# EAGLE board RF08old (EAGLE 6.6.0), part 1 of 2
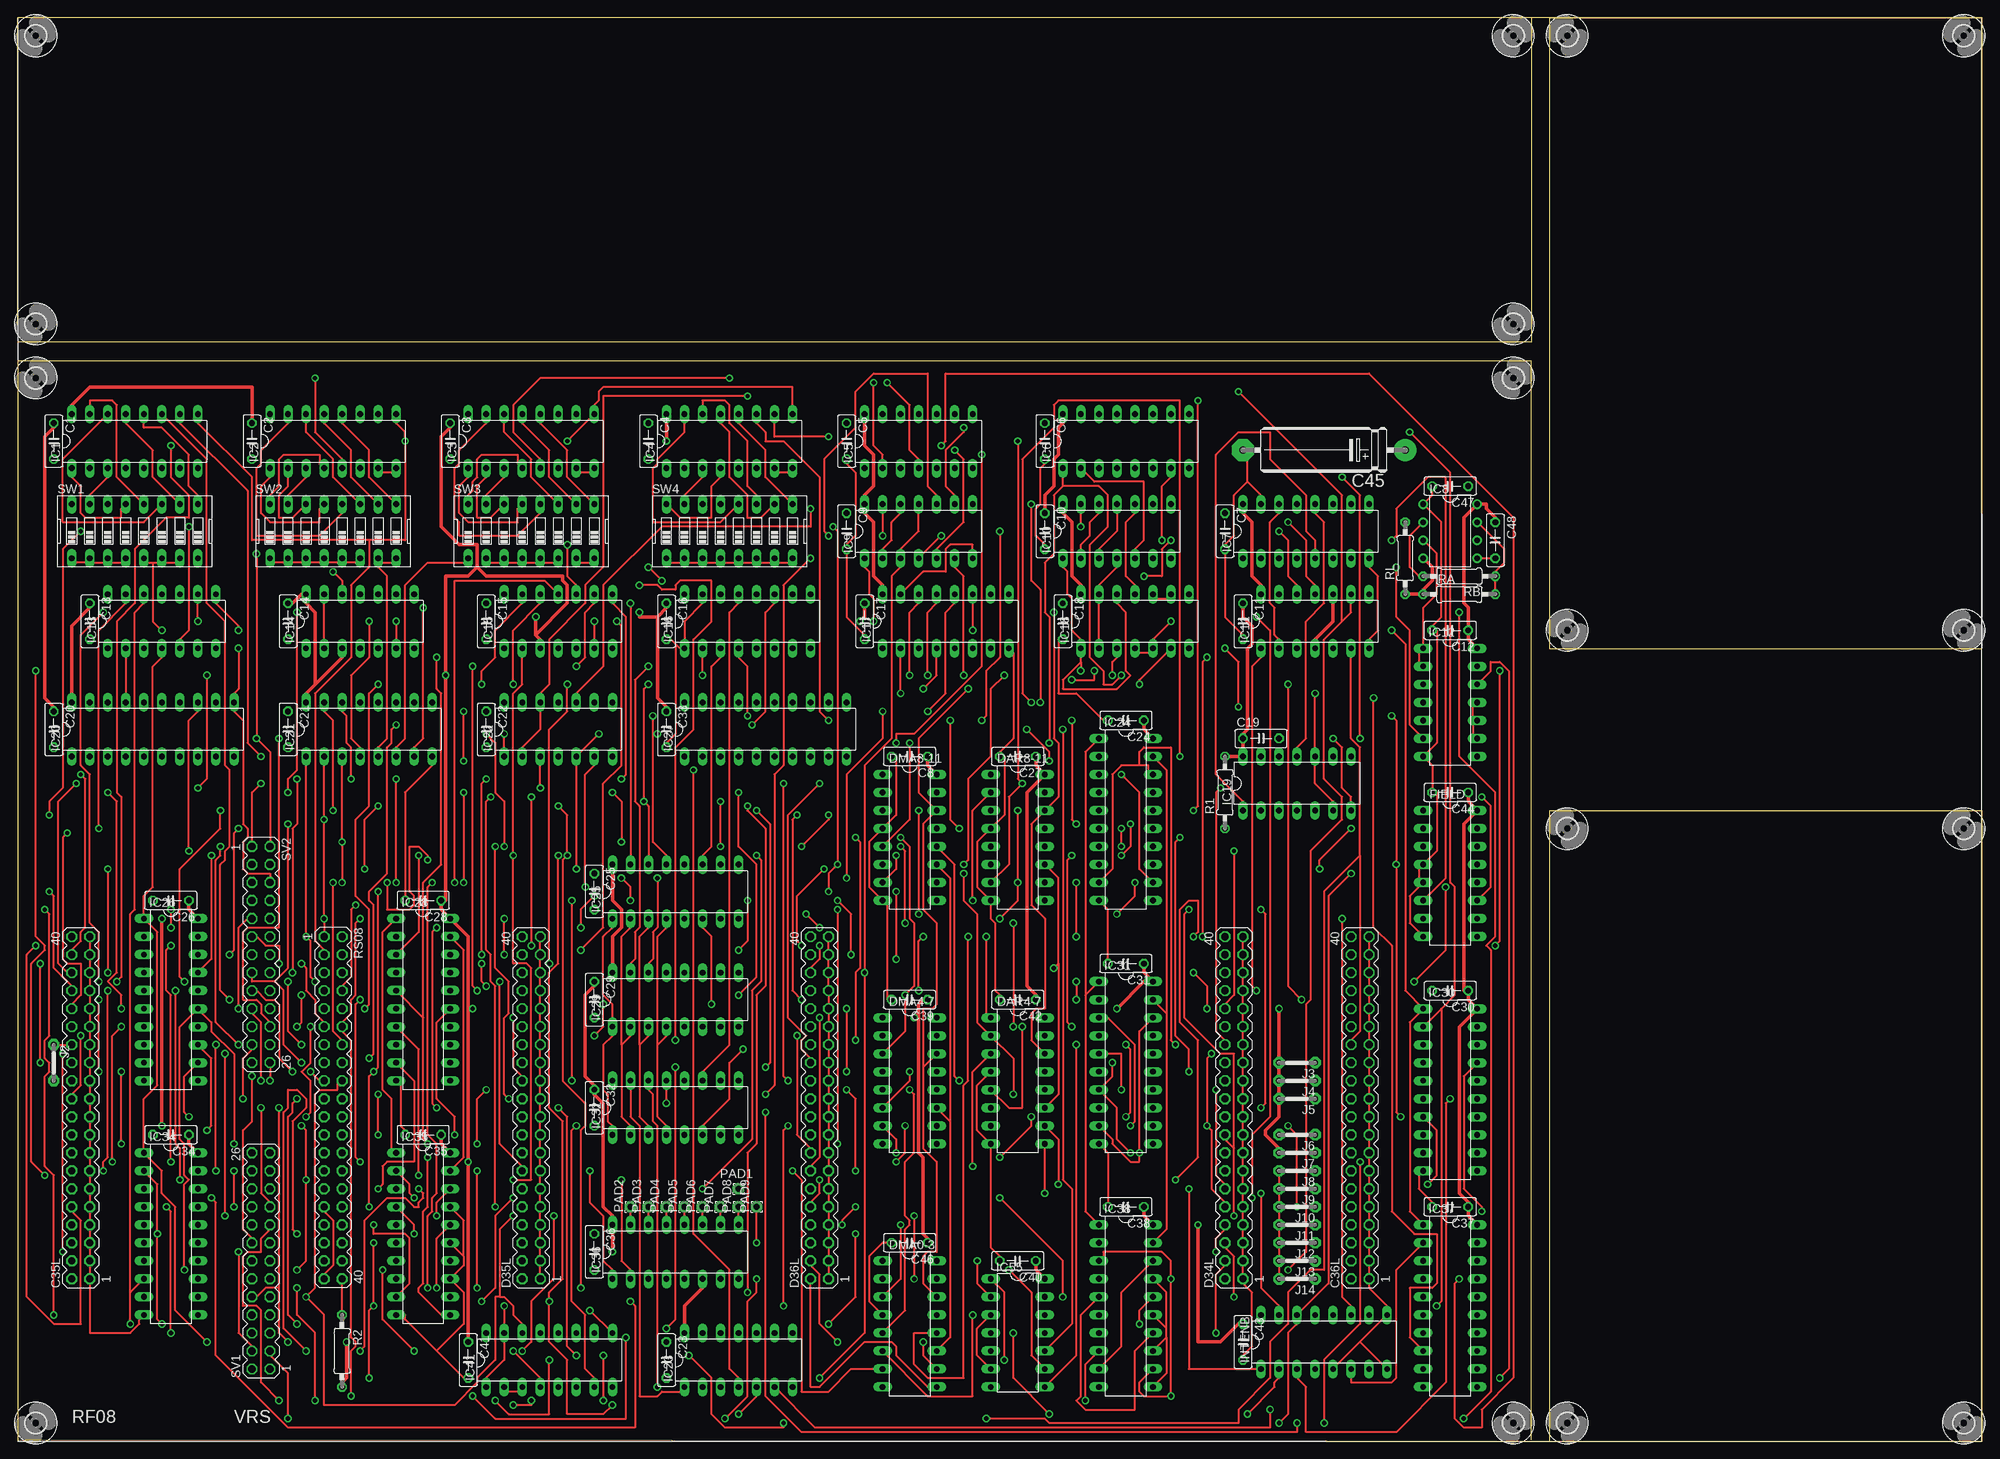
[diagram p3: board, top side]
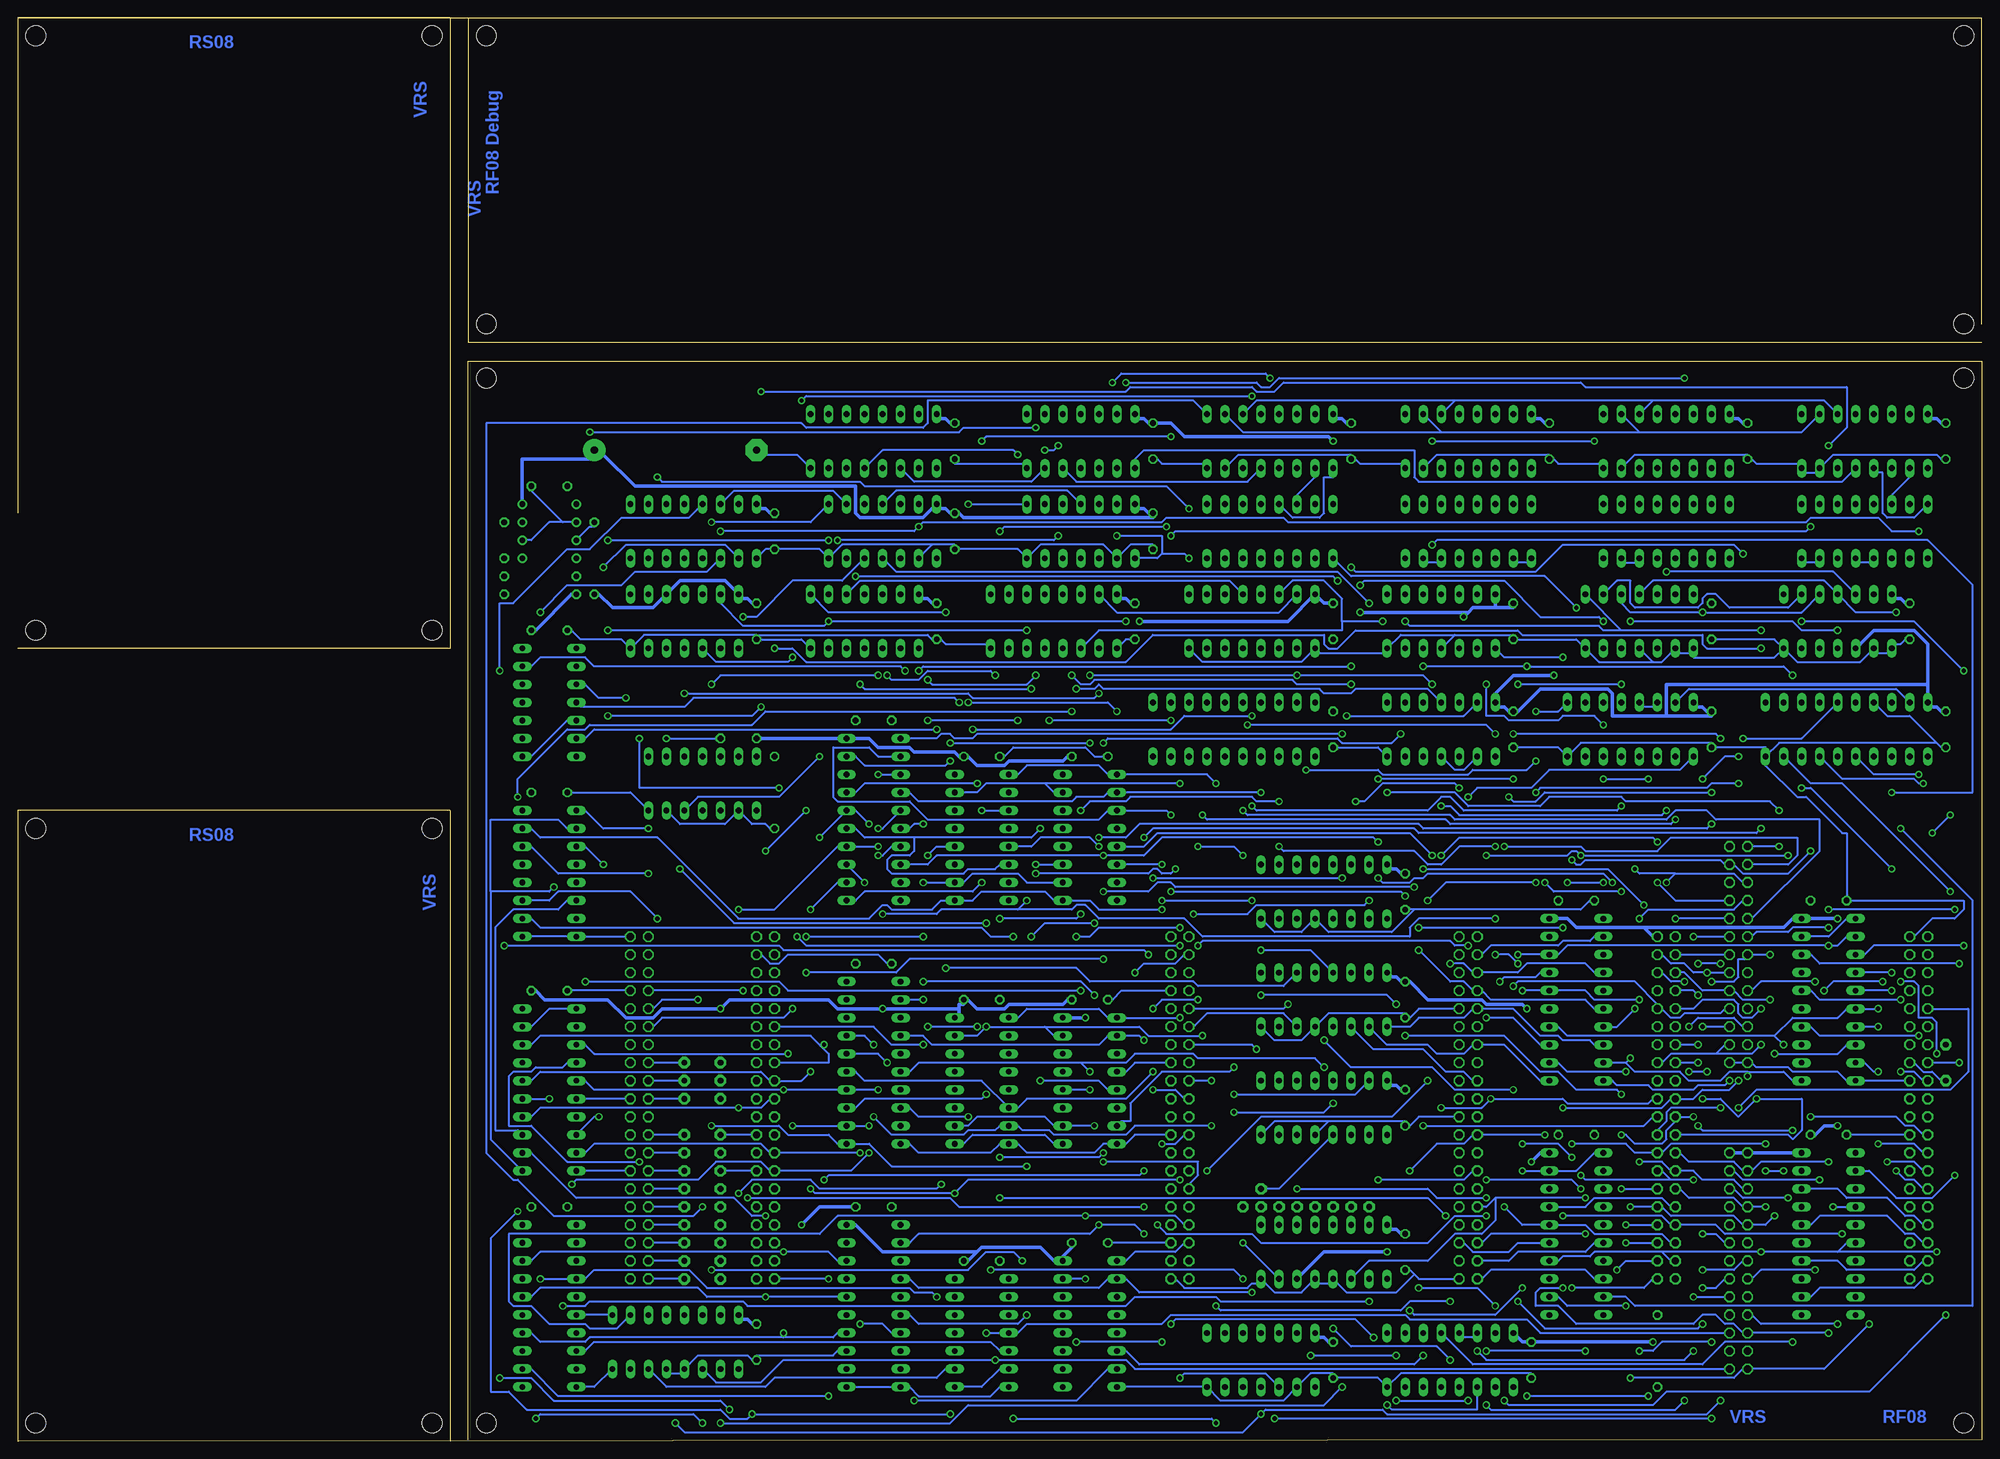
[diagram p4: board, bottom side, seen from below]

Size 276.86 x 200.67 mm. Coordinates in mm from the lower left corner, seen from the top.
Outline: 276.69,0 0.01,0.18 0.01,152.25 213.34,152.25 213.34,0.18
Outline: 215.9,0.01 215.9,88.92 276.86,88.92 276.86,0.01
Outline: 276.86,111.78 215.9,111.78 215.9,200.67 276.86,200.67
Outline: 276.86,200.67 0,200.67 0,157.49
Outline: 276.86,200.67 276.86,130.82
Outline: 0,154.95 213.36,154.95 213.36,200.67
Copper layers (1*16): Top 0.035mm / dielectric 1.5mm / Bottom 0.035mm
Design rules "olimex10mil": minimum track width 10mil, minimum drill 24mil, track to track 10mil, track to pad 10mil, pad to pad 10mil, via to via 10mil, smd to smd 10mil, copper to edge 40mil, drill to drill 10mil, minimum pad ring 10mil, minimum via ring 8mil, stop-mask expansion 0mil, vias tented up to drill 0mil, thermal gap 10mil
Net classes: 1 Power: width 0.508 mm

## Footprints (pad centres in the part's own frame; a part is rotated, then mirrored left to right if it is on the bottom)
C050-025X075 = drill 0.813 octagon: 1 -2.54,0; 2 2.54,0
MA20-2 = drill 1.016 octagon: 1 -24.13,-1.27; 2 -24.13,1.27; 3 -21.59,-1.27; 4 -21.59,1.27; 5 -19.05,-1.27; 6 -19.05,1.27; 7 -16.51,-1.27; 8 -16.51,1.27; 9 -13.97,-1.27; 10 -13.97,1.27; 11 -11.43,-1.27; 12 -11.43,1.27; 13 -8.89,-1.27; 14 -8.89,1.27; 15 -6.35,-1.27; 16 -6.35,1.27; 17 -3.81,-1.27; 18 -3.81,1.27; 19 -1.27,-1.27; 20 -1.27,1.27; 21 1.27,-1.27; 22 1.27,1.27; 23 3.81,-1.27; 24 3.81,1.27; 25 6.35,-1.27; 26 6.35,1.27; 27 8.89,-1.27; 28 8.89,1.27; 29 11.43,-1.27; 30 11.43,1.27; 31 13.97,-1.27; 32 13.97,1.27; 33 16.51,-1.27; 34 16.51,1.27; 35 19.05,-1.27; 36 19.05,1.27; 37 21.59,-1.27; 38 21.59,1.27; 39 24.13,-1.27; 40 24.13,1.27
E22-6 = drill 1.016 pad 3.15: + -11.43,0 | drill 1.016 pad 3.15 octagon: - 11.43,0
DIL16 = drill 0.813 long: 1 -8.89,-3.81; 2 -6.35,-3.81; 3 -3.81,-3.81; 4 -1.27,-3.81; 5 1.27,-3.81; 6 3.81,-3.81; 7 6.35,-3.81; 8 8.89,-3.81; 9 8.89,3.81; 10 6.35,3.81; 11 3.81,3.81; 12 1.27,3.81; 13 -1.27,3.81; 14 -3.81,3.81; 15 -6.35,3.81; 16 -8.89,3.81
DIL14 = drill 0.813 long: 1 -7.62,-3.81; 2 -5.08,-3.81; 3 -2.54,-3.81; 4 0,-3.81; 5 2.54,-3.81; 6 5.08,-3.81; 7 7.62,-3.81; 8 7.62,3.81; 9 5.08,3.81; 10 2.54,3.81; 11 0,3.81; 12 -2.54,3.81; 13 -5.08,3.81; 14 -7.62,3.81
DIL08 = drill 0.813 pad 1.27: 1 -3.81,-3.81; 2 -1.27,-3.81; 3 1.27,-3.81; 4 3.81,-3.81; 5 3.81,3.81; 6 1.27,3.81; 7 -1.27,3.81; 8 -3.81,3.81
DIL20 = drill 0.813 long: 1 -11.43,-3.81; 2 -8.89,-3.81; 3 -6.35,-3.81; 4 -3.81,-3.81; 5 -1.27,-3.81; 6 1.27,-3.81; 7 3.81,-3.81; 8 6.35,-3.81; 9 8.89,-3.81; 10 11.43,-3.81; 11 11.43,3.81; 12 8.89,3.81; 13 6.35,3.81; 14 3.81,3.81; 15 1.27,3.81; 16 -1.27,3.81; 17 -3.81,3.81; 18 -6.35,3.81; 19 -8.89,3.81; 20 -11.43,3.81
05 = drill 0.813 pad 1.6 octagon: 1 -2.54,0; 2 2.54,0
1,6/0,8 = drill 0.813 pad 1.6 octagon: 1 0,0
0207/10 = drill 0.813 octagon: 1 -5.08,0; 2 5.08,0
MA13-2 = drill 1.016 octagon: 1 -15.24,-1.27; 2 -15.24,1.27; 3 -12.7,-1.27; 4 -12.7,1.27; 5 -10.16,-1.27; 6 -10.16,1.27; 7 -7.62,-1.27; 8 -7.62,1.27; 9 -5.08,-1.27; 10 -5.08,1.27; 11 -2.54,-1.27; 12 -2.54,1.27; 13 0,-1.27; 14 0,1.27; 15 2.54,-1.27; 16 2.54,1.27; 17 5.08,-1.27; 18 5.08,1.27; 19 7.62,-1.27; 20 7.62,1.27; 21 10.16,-1.27; 22 10.16,1.27; 23 12.7,-1.27; 24 12.7,1.27; 25 15.24,-1.27; 26 15.24,1.27
EDG-08 = drill 0.813 long: 1 -8.89,-3.81; 2 -6.35,-3.81; 3 -3.81,-3.81; 4 -1.27,-3.81; 5 1.27,-3.81; 6 3.81,-3.81; 7 6.35,-3.81; 8 8.89,-3.81; 9 8.89,3.81; 10 6.35,3.81; 11 3.81,3.81; 12 1.27,3.81; 13 -1.27,3.81; 14 -3.81,3.81; 15 -6.35,3.81; 16 -8.89,3.81
2,8 = hole 2.8: 0,0

## Placement (x,y rotation side)
C1  0.1  [C050-025X075]  5.08,140.98 270 top
C2  0.1  [C050-025X075]  33.02,140.98 270 top
C3  0.1  [C050-025X075]  60.96,140.98 270 top
C4  0.1  [C050-025X075]  88.9,140.98 270 top
C5  0.1  [C050-025X075]  116.84,140.98 270 top
C6  0.1  [C050-025X075]  144.78,140.98 270 top
C7  0.1  [C050-025X075]  170.18,128.28 270 top
C8  0.1  [C050-025X075]  125.73,96.53 180 top
C9  0.1  [C050-025X075]  116.84,128.28 270 top
C10  0.1  [C050-025X075]  144.78,128.28 270 top
C11  0.1  [C050-025X075]  172.72,115.58 270 top
C12  0.1  [C050-025X075]  201.93,114.31 180 top
C13  0.1  [C050-025X075]  10.16,115.58 270 top
C14  0.1  [C050-025X075]  38.1,115.58 270 top
C15  0.1  [C050-025X075]  66.04,115.58 270 top
C16  0.1  [C050-025X075]  91.44,115.58 270 top
C17  0.1  [C050-025X075]  119.38,115.58 270 top
C18  0.1  [C050-025X075]  147.32,115.58 270 top
C19  0.1  [C050-025X075]  175.26,99.08 0 top
C20  0.1  [C050-025X075]  5.08,100.34 270 top
C21  0.1  [C050-025X075]  38.1,100.34 270 top
C22  0.1  [C050-025X075]  66.04,100.34 270 top
C23  0.1  [C050-025X075]  91.44,11.45 270 top
C24  0.1  [C050-025X075]  156.21,101.61 180 top
C25  0.1  [C050-025X075]  81.28,77.48 270 top
C26  0.1  [C050-025X075]  21.59,76.22 180 top
C27  0.1  [C050-025X075]  140.97,96.53 180 top
C28  0.1  [C050-025X075]  57.15,76.22 180 top
C29  0.1  [C050-025X075]  81.28,62.24 270 top
C30  0.1  [C050-025X075]  201.93,63.52 180 top
C31  0.1  [C050-025X075]  156.21,67.33 180 top
C32  0.1  [C050-025X075]  81.28,47.01 270 top
C33  0.1  [C050-025X075]  91.44,100.34 270 top
C34  0.1  [C050-025X075]  21.59,43.2 180 top
C35  0.1  [C050-025X075]  57.15,43.2 180 top
C35L  [MA20-2]  8.89,47.01 90 top
C36  0.1  [C050-025X075]  81.28,26.69 270 top
C36L  [MA20-2]  189.23,47.01 90 top
C37  0.1  [C050-025X075]  201.93,33.04 180 top
C38  0.1  [C050-025X075]  156.21,33.04 180 top
C39  0.1  [C050-025X075]  125.73,62.24 180 top
C40  0.1  [C050-025X075]  140.97,25.41 180 top
C41  0.1  [C050-025X075]  63.5,11.45 270 top
C42  0.1  [C050-025X075]  140.97,62.24 180 top
C43  0.1  [C050-025X075]  172.72,13.99 270 top
C44  0.1  [C050-025X075]  201.93,91.45 180 top
C45  100uf  [E22-6]  184.15,139.71 180 top
C46  0.1  [C050-025X075]  125.73,27.96 180 top
C47  0.1  [C050-025X075]  201.93,134.63 180 top
C48  0.1  [C050-025X075]  208.28,127.02 270 top
D34L  [MA20-2]  171.45,47.01 90 top
D35L  [MA20-2]  72.39,47.01 90 top
D36L  [MA20-2]  113.03,47.01 90 top
DAR4-7  74LS193N  [DIL16]  140.97,50.81 270 top
DAR8-11  74LS193N  [DIL16]  140.97,85.11 270 top
DMA0-3  74LS193N  [DIL16]  125.73,16.53 270 top
DMA4-7  74LS193N  [DIL16]  125.73,50.81 270 top
DMA8-11  74LS193N  [DIL16]  125.73,85.11 270 top
FIELD  74LS193N  [DIL16]  201.93,80.03 270 top
IC1  74LS151N  [DIL16]  16.51,140.98 0 top
IC2  74LS151N  [DIL16]  44.45,140.98 0 top
IC3  74LS151N  [DIL16]  72.39,140.98 0 top
IC4  74LS151N  [DIL16]  100.33,140.98 0 top
IC5  74LS20N  [DIL14]  127,140.98 0 top
IC6  74LS139N  [DIL16]  156.21,140.98 0 top
IC7  74LS139N  [DIL16]  181.61,128.28 0 top
IC8  LM555N  [DIL08]  201.93,128.28 270 top
IC9  74S74N  [DIL14]  127,128.28 0 top
IC10  74S74N  [DIL14]  154.94,128.28 0 top
IC11  74S74N  [DIL14]  182.88,115.58 0 top
IC12  74LS00N  [DIL14]  201.93,104.16 270 top
IC13  74180N  [DIL14]  20.32,115.58 0 top
IC14  74180N  [DIL14]  48.26,115.58 0 top
IC15  74180N  [DIL14]  76.2,115.58 0 top
IC16  74LS139N  [DIL16]  102.87,115.58 0 top
IC17  74LS139N  [DIL16]  130.81,115.58 0 top
IC18  74LS00N  [DIL14]  157.48,115.58 0 top
IC19  7407N  [DIL14]  180.34,92.72 0 top
IC20  74S240N  [DIL20]  19.05,100.34 0 top
IC21  74LS139N  [DIL16]  49.53,100.34 0 top
IC22  7407N  [DIL14]  76.2,100.34 0 top
IC23  74S74N  [DIL14]  101.6,11.45 0 top
IC24  74S240N  [DIL20]  156.21,87.64 270 top
IC25  74S138N  [DIL16]  92.71,77.48 0 top
IC26  74S240N  [DIL20]  21.59,62.24 270 top
IC27  SPARE  [DIL20]  105.41,100.34 0 top
IC28  74LS244N  [DIL20]  57.15,62.24 270 top
IC29  74S138N  [DIL16]  92.71,62.24 0 top
IC30  74S240N  [DIL20]  201.93,49.55 270 top
IC31  74S240N  [DIL20]  156.21,53.36 270 top
IC32  74S138N  [DIL16]  92.71,47.01 0 top
IC34  74S240N  [DIL20]  21.59,29.23 270 top
IC35  74LS244N  [DIL20]  57.15,29.23 270 top
IC36  74S138N  [DIL16]  92.71,26.69 0 top
IC37  74S240N  [DIL20]  201.93,19.07 270 top
IC38  74S240N  [DIL20]  156.21,19.07 270 top
IC41  74LS139N  [DIL16]  74.93,11.45 0 top
IC55  7438N  [DIL14]  140.97,15.26 270 top
INTENB  74LS193N  [DIL16]  184.15,13.99 0 top
J2  J5MM  [05]  5.08,53.36 270 top
J3  J5MM  [05]  180.34,53.36 180 top
J4  J5MM  [05]  180.34,50.81 180 top
J5  J5MM  [05]  180.34,48.27 180 top
J6  J5MM  [05]  180.34,43.2 180 top
J7  J5MM  [05]  180.34,40.66 180 top
J8  J5MM  [05]  180.34,38.12 180 top
J9  J5MM  [05]  180.34,35.58 180 top
J10  J5MM  [05]  180.34,33.04 180 top
J11  J5MM  [05]  180.34,30.5 180 top
J12  J5MM  [05]  180.34,27.96 180 top
J13  J5MM  [05]  180.34,25.41 180 top
J14  J5MM  [05]  180.34,22.88 180 top
PAD1  [1,6/0,8]  101.6,35.58 90 top
PAD2  [1,6/0,8]  86.36,33.04 90 top
PAD3  [1,6/0,8]  88.9,33.04 90 top
PAD4  [1,6/0,8]  91.44,33.04 90 top
PAD5  [1,6/0,8]  93.98,33.04 90 top
PAD6  [1,6/0,8]  96.52,33.04 90 top
PAD7  [1,6/0,8]  99.06,33.04 90 top
PAD8  [1,6/0,8]  101.6,33.04 90 top
PAD9  [1,6/0,8]  104.14,33.04 90 top
R1  4.7K  [0207/10]  170.18,91.45 90 top
R2  4.7K  [0207/10]  45.72,12.71 270 top
RA  470K  [0207/10]  203.2,119.39 0 top
RB  1.5K  [0207/10]  203.2,121.94 180 top
RL  1K  [0207/10]  195.58,124.47 90 top
RS08  [MA20-2]  44.45,47.01 270 top
SV1  [MA13-2]  34.29,25.41 90 top
SV2  [MA13-2]  34.29,68.59 270 top
SW1  [EDG-08]  16.51,128.28 0 top
SW2  [EDG-08]  44.45,128.28 0 top
SW3  [EDG-08]  72.39,128.28 0 top
SW4  [EDG-08]  100.33,128.28 0 top
U$1  [2,8]  2.54,149.88 0 top
U$2  [2,8]  210.82,149.88 0 top
U$3  [2,8]  2.54,2.56 0 top
U$4  [2,8]  210.82,2.56 0 top
U$5  [2,8]  274.32,2.56 90 top
U$6  [2,8]  218.44,2.56 90 top
U$7  [2,8]  218.44,86.38 90 top
U$8  [2,8]  274.32,86.38 90 top
U$9  [2,8]  274.32,198.13 90 top
U$10  [2,8]  274.32,114.31 90 top
U$11  [2,8]  218.44,114.31 90 top
U$12  [2,8]  218.44,198.13 90 top
U$13  [2,8]  2.54,157.49 0 top
U$14  [2,8]  2.54,198.13 0 top
U$16  [2,8]  210.82,157.49 0 top
U$17  [2,8]  210.82,198.13 0 top
U$18  [SIERRA-PROTO]  0,0.01 0 top

## Tracks (layer width: path | path; a pad name or v marks a point on that pad's centre or on a via)
!3CYC
  Top 0.254: J2.1 C35L.28
!601  (via drill 0.61)
  Top 0.254: IC23.1 93.34,7 90.81,7 90.17,6.36 87.63,6.36 87.63,44.47 86.36,45.73 IC32.15 | IC9.13 v121.92,127.65 | IC18.4 158.12,111.14 159.38,111.14 IC18.5 160.02,113.05 v162.56,115.58 | v120.65,115.58 120.65,118.76 120.02,119.39 120.02,122.57 119.38,123.2 IC9.1 | v105.41,48.91 106.68,50.18 106.68,94 107.95,95.27 107.95,120.67 v111.76,124.47
  Bottom 0.254: 115.57,125.11 116.2,124.47 IC9.1 | 115.57,125.11 115.57,127.65 v121.92,127.65 | IC11.13 177.8,118.12 174.62,114.95 163.19,114.95 v162.56,115.58 v120.65,115.58 | v105.41,48.91 88.27,48.91 IC32.15 | v111.76,124.47 112.39,125.11 115.57,125.11
!602  (via drill 0.61)
  Top 0.254: v88.9,109.23 87,107.33 87,90.19 87.63,89.55 87.63,72.41 87,71.77 87,67.96 86.36,67.33 IC29.15 | 149.86,109.87 v149.86,108.6 | 149.86,109.87 IC18.1 149.86,113.05 148.59,114.31 148.59,118.76 147.96,119.39 147.96,122.57 147.32,123.2 IC10.1 | 149.86,109.87 147.32,107.33 147.32,106.06 154.94,106.06 156.84,107.97 156.21,108.6 156.21,116.86 154.94,118.12 IC18.12
  Bottom 0.254: v88.9,109.23 149.22,109.23 v149.86,108.6
!604  (via drill 0.61)
  Top 0.254: IC18.2 IC18.13 152.4,120.67 154.94,123.2 IC10.4 | v86.36,118.12 IC25.15
  Bottom 0.254: v86.36,118.12 90.81,122.57 153.03,122.57 IC10.4
!611  (via drill 0.61)
  Top 0.254: v90.17,7.63 90.17,44.47 89.53,45.1 89.53,48.91 88.9,49.55 IC32.14 | v177.8,2.56 179.07,3.83 179.07,15.26 180.34,16.53 INTENB.14 184.78,22.24 184.78,76.85 v187.96,80.03
  Bottom 0.254: v90.17,7.63 92.71,5.09 142.88,5.09 145.41,2.56 v177.8,2.56 | v187.96,80.03 200.66,80.03 204.47,83.83 FIELD.14
!612  (via drill 0.61)
  Top 0.254: v90.17,79.39 90.17,72.41 89.53,71.77 89.53,67.96 88.9,67.33 IC29.14 | v116.84,79.39 116.84,94 121.92,99.08 v121.92,102.89 | v142.88,104.16 141.6,105.42 141.6,138.44 146.05,142.89 146.05,146.06 146.69,146.7 163.83,146.7 v163.83,96.53
  Bottom 0.254: v116.84,79.39 v90.17,79.39 | v121.92,102.89 123.19,104.16 v142.88,104.16 | v163.83,96.53 169.54,90.82 180.97,90.82 IC19.5
!614  (via drill 0.61)
  Top 0.254: v73.66,92.09 IC22.3 | IC25.14 88.9,89.55 v88.27,90.19 88.27,106.06 v88.9,106.7 | v128.27,107.97 128.27,116.86 129.54,118.12 IC17.13
  Bottom 0.254: v73.66,92.09 74.3,92.72 84.45,92.72 87,90.19 v88.27,90.19 | v128.27,107.97 127,106.7 125.73,106.7 125.09,107.33 97.16,107.33 96.52,106.7 v88.9,106.7
!621  (via drill 0.61)
  Top 0.254: v105.41,46.37 105.41,6.36 110.49,1.28 180.34,1.28 v180.34,2.56 | v203.84,3.19 207.65,7 207.65,69.23 207.01,69.86 208.28,71.14 208.28,91.45 203.2,96.53 v203.2,116.86 | v91.44,47.64 IC32.13
  Bottom 0.254: v91.44,47.64 92.71,46.37 v105.41,46.37 | v180.34,2.56 181.61,3.83 203.2,3.83 v203.84,3.19 | v203.2,116.86 199.39,120.67 191.77,120.67 189.87,122.57 179.71,122.57 IC7.3
!622  (via drill 0.61)
  Top 0.254: v101.6,69.23 102.87,70.5 v102.87,76.22 | v115.57,76.22 117.47,74.31 v117.47,68.59 | v208.28,69.86 208.91,70.5 v208.91,108.6
  Bottom 0.254: v101.6,69.23 94.61,69.23 IC29.13 | v115.57,76.22 v102.87,76.22 | v117.47,68.59 118.11,69.23 168.91,69.23 169.54,69.86 v208.28,69.86 | v208.91,108.6 208.91,118.12 207.01,118.12 199.39,125.75 196.22,125.75 191.77,130.19 182.25,130.19 IC7.13
!624  (via drill 0.61)
  Top 0.254: 89.53,99.71 v89.53,102.25 | 89.53,99.71 89.53,84.47 91.44,82.56 IC25.13 | 150.5,62.88 150.5,32.4 IC38.1 | 150.5,62.88 IC31.1 | 150.5,62.88 150.5,97.17 IC24.1 | 89.53,99.71 v90.17,99.71
  Bottom 0.254: v89.53,102.25 73.03,102.25 IC22.13 | v90.17,99.71 141.6,99.71 142.24,99.08 144.78,99.08 145.41,99.71 146.69,99.71 147.32,99.08 IC24.1
!641
  Top 0.254: IC32.11 96.52,52.09 100.33,55.9 100.33,116.86 101.6,118.12 IC16.13
!642  (via drill 0.61)
  Top 0.254: v146.05,66.69 146.69,67.33 | 146.69,67.33 146.69,79.39 DAR8-11.11 | 146.69,67.33 146.69,48.91 DAR4-7.11
  Bottom 0.254: v146.05,66.69 127.64,66.69 125.73,64.78 111.12,64.78 110.49,64.15 98.42,64.15 IC29.11
!644
  Top 0.254: IC25.11 96.52,82.56 97.79,83.83 97.79,109.23 99.06,110.5 IC16.3
!645  (via drill 0.61)
  Top 0.254: 161.93,60.34 161.93,29.86 IC38.19 | 161.93,60.34 IC31.19 | 161.93,60.34 161.93,94.63 IC24.19 | v102.87,102.25 102.87,109.23 101.6,110.5 IC16.4 | v142.24,100.34 145.41,97.17 v145.41,95.9
  Bottom 0.254: v102.87,102.25 112.39,102.25 114.3,100.34 v142.24,100.34 | v145.41,95.9 146.05,95.27 157.48,95.27 158.75,96.53 IC24.19
!ACB00  (via drill 0.61)
  Top 0.254: IC38.12 158.12,8.27 158.12,7 158.75,6.36 v162.56,6.36 v162.56,22.88 162.56,25.41 161.29,26.69 153.03,26.69 153.03,26.05 IC38.3
  Bottom 0.254: v162.56,6.36 200.66,6.36 204.47,10.18 IC37.12 | v162.56,22.88 D34L.2
!ACB01  (via drill 0.61)
  Top 0.254: IC38.5 149.86,17.8 149.86,6.36 149.22,5.73 150.5,4.46 157.48,4.46 157.48,12.71 IC38.14 | v168.91,15.26 168.91,23.51 170.18,24.78 D34L.4
  Bottom 0.254: 168.91,14.62 196.22,14.62 196.85,13.99 203.2,13.99 204.47,15.26 IC37.14 | 168.91,14.62 161.93,14.62 161.29,15.26 IC38.14 | 168.91,14.62 v168.91,15.26
!ACB02  (via drill 0.61)
  Top 0.254: v158.12,16.53 158.12,18.43 IC38.16 | v171.45,20.34 171.45,26.05 170.18,27.32 D34L.6
  Bottom 0.254: v158.12,16.53 154.94,16.53 153.67,15.26 IC38.7 | IC37.16 204.47,20.34 203.2,21.61 180.97,21.61 179.71,20.34 v171.45,20.34 IC38.16
!ACB03  (via drill 0.61)
  Top 0.254: IC38.9 155.57,13.35 155.57,20.97 IC38.18 | v168.91,26.69 168.91,28.59 170.18,29.86 D34L.8
  Bottom 0.254: IC37.18 204.47,25.41 203.2,26.69 v168.91,26.69 162.56,26.69 161.29,25.41 IC38.18
!ACB04  (via drill 0.61)
  Top 0.254: D34L.10 170.18,33.67 168.28,35.58 168.28,43.83 v167.64,44.47 167.64,53.99 v168.28,54.62 | v156.84,44.47 157.48,45.1 157.48,55.9 153.67,59.7 IC31.3
  Bottom 0.254: v167.64,44.47 IC31.12 v156.84,44.47 | v168.28,54.62 195.58,54.62 196.85,55.9 IC30.3
!ACB05  (via drill 0.61)
  Top 0.254: v155.57,49.55 155.57,54.62 IC31.5 | v168.91,49.55 168.91,37.48 170.18,36.21 D34L.12
  Bottom 0.254: v155.57,49.55 IC31.14 v168.91,49.55 195.58,49.55 196.85,50.81 IC30.5
!ACB06  (via drill 0.61)
  Top 0.254: v154.31,53.36 154.31,51.45 IC31.7 154.94,47.01 154.94,42.56 v156.84,40.66 | v198.75,36.21 200.03,37.48 200.03,43.83 IC30.7
  Bottom 0.254: v154.31,53.36 155.57,54.62 IC31.16 | v198.75,36.21 198.12,36.84 180.97,36.84 178.44,39.38 172.09,39.38 170.81,38.12 D34L.14 159.38,38.12 v156.84,40.66
!ACB07  (via drill 0.61)
  Top 0.254: IC31.9 154.31,42.56 154.31,41.92 156.84,39.38 158.12,39.38 v158.12,40.66 158.12,57.8 IC31.18
  Bottom 0.254: IC30.9 196.85,40.66 195.58,41.92 172.09,41.92 170.81,40.66 D34L.16 v158.12,40.66
!ACB08  (via drill 0.61)
  Top 0.254: v155.57,94 158.12,91.45 158.12,80.66 IC24.12 | v171.45,31.77 171.45,41.29 | 171.45,41.29 170.18,42.56 D34L.18 | v165.1,74.95 164.47,74.31 164.47,59.7 169.54,54.62 171.45,54.62 171.45,41.29
  Bottom 0.254: v155.57,94 IC24.3 | v171.45,31.77 173.35,31.77 175.9,34.3 198.12,34.3 204.47,40.66 IC30.12 | v165.1,74.95 161.29,78.75 IC24.12
!ACB09  (via drill 0.61)
  Top 0.254: v155.57,83.83 v155.57,86.38 | v175.26,74.95 175.9,74.31 175.9,47.64 v175.26,47.01
  Bottom 0.254: v155.57,86.38 154.94,86.38 IC24.5 | v155.57,83.83 IC24.14 161.29,83.83 170.18,74.95 v175.26,74.95 | IC30.14 204.47,45.73 203.2,47.01 v175.26,47.01 172.09,47.01 170.81,48.27 D34L.22
!ACB10  (via drill 0.61)
  Top 0.254: v155.57,82.56 156.84,83.83 v156.84,87.01 | v163.83,85.11 163.19,84.47 163.19,57.16 165.1,55.26 v165.1,52.09
  Bottom 0.254: v155.57,82.56 154.94,82.56 153.67,83.83 IC24.7 | v156.84,87.01 158.75,88.92 IC24.16 v163.83,85.11 | IC30.16 204.47,50.81 203.2,52.09 172.09,52.09 170.81,50.81 D34L.24 166.37,50.81 v165.1,52.09
!ACB11  (via drill 0.61)
  Top 0.254: 158.12,95.27 159.38,95.27 159.38,94.63 IC24.18 | 158.12,95.27 155.57,95.27 154.31,94 154.31,80.66 IC24.9 | 158.12,95.27 158.12,97.17 158.75,97.81 162.56,97.81 162.56,56.53 v163.19,55.9
  Bottom 0.254: 163.83,55.9 162.56,54.62 162.56,53.36 D34L.26 | 163.83,55.9 165.1,57.16 203.2,57.16 204.47,55.9 IC30.18 | v163.19,55.9 163.83,55.9
!ACCLEAR  (via drill 0.61)
  Top 0.254: IC22.2 71.12,97.81 73.66,100.34 IC22.12 73.66,105.42 74.93,106.7 74.93,113.05 80.01,118.12 80.01,120.67 82.55,123.2 82.55,147.33 v102.87,147.33 | v171.45,83.2 171.45,62.88 170.18,61.61 D34L.32 | v165.74,88.92 166.37,89.55 v166.37,146.7
  Bottom 0.254: IC22.4 74.3,94.63 73.03,94.63 IC22.2 | v165.74,88.92 v171.45,83.2 | v166.37,146.7 165.74,147.33 v102.87,147.33
!BADDAC  (via drill 0.61)
  Top 0.254: v174.62,63.52 173.99,64.15 173.99,109.23 175.26,110.5 IC11.1
  Bottom 0.254: v174.62,63.52 C36L.34
!BBREAK  (via drill 0.61)
  Top 0.254: IC41.1 66.04,8.91 68.58,11.45 IC41.15 v68.58,19.07 | v125.73,98.44 125.73,87.64 DMA8-11.5 | v145.41,98.44 145.41,116.22 144.78,116.86 144.78,123.84 146.05,125.11 146.05,133.36 147.32,134.63 | 147.32,134.63 IC6.1 | v180.97,62.24 179.07,64.15 v179.07,106.7 | v155.57,107.97 154.31,106.7 153.03,106.7 153.03,108.6 151.13,110.5 151.13,126.38 153.67,128.92 153.67,133.36 152.4,134.63 147.32,134.63 | v79.38,21.61 79.38,43.83 80.01,44.47 80.01,47.64 76.83,50.81 76.83,81.93 v77.47,82.56 77.47,88.28 v76.2,89.55 | v44.45,88.92 44.45,101.61 43.18,102.89 IC21.15
  Bottom 0.254: IC20.19 12.06,106.06 41.27,106.06 IC21.15 | v145.41,98.44 v125.73,98.44 | v180.97,62.24 186.06,62.24 187.32,60.98 C36L.32 | v179.07,106.7 177.8,107.97 v155.57,107.97 | v68.58,19.07 71.12,21.61 v79.38,21.61 | v77.47,82.56 80.64,85.74 116.2,85.74 118.11,83.83 DMA8-11.5 | v44.45,88.92 45.09,88.28 73.66,88.28 74.93,89.55 v76.2,89.55
!BRK_RQ  (via drill 0.61)
  Top 0.254: 189.23,82.56 189.23,57.8 187.96,56.53 C36L.28 | 189.23,82.56 189.23,97.81 187.96,99.08 IC11.6 | v39.37,21.61 39.37,17.8 41.91,15.26 v41.91,5.73 | v69.85,5.09 72.39,5.09 v72.39,5.73 | v82.55,12.08 v82.55,5.73 | v94.61,12.08 97.79,8.91 97.79,3.83 99.69,1.92 107.95,1.92 v107.95,2.56 | v136.53,3.19 144.78,3.19 145.41,2.56 172.09,2.56 172.09,4.46 176.53,8.91 176.53,13.99 179.07,16.53 179.07,20.97 182.25,24.14 184.15,24.14 184.15,77.48 189.23,82.56
  Bottom 0.254: v39.37,21.61 37.47,21.61 36.2,22.88 SV1.11 | v41.91,5.73 43.18,4.46 69.22,4.46 v69.85,5.09 | v82.55,5.73 v72.39,5.73 | v94.61,12.08 v82.55,12.08 | v107.95,2.56 108.58,3.19 v136.53,3.19
!BWC0  (via drill 0.61)
  Top 0.254: v177.8,128.28 179.07,127.02 179.07,121.94 180.34,120.67 IC11.12 | v149.86,128.92 IC10.13 | v34.29,47.01 34.29,34.94 35.56,33.67 SV1.19 | v8.89,128.28 6.35,125.75 6.35,92.09 4.45,90.19 v4.45,88.28 | v6.99,85.74 6.35,85.11 6.35,67.96 6.99,67.33 8.89,67.33 8.89,62.88 7.62,61.61 C35L.32
  Bottom 0.254: v177.8,128.28 150.5,128.28 v149.86,128.92 149.22,129.55 115.57,129.55 114.94,130.19 98.42,130.19 97.79,129.55 24.77,129.55 24.13,130.19 14.61,130.19 12.7,128.28 v8.89,128.28 | v34.29,47.01 31.75,49.55 4.45,49.55 1.91,52.09 1.91,60.98 C35L.32 | v4.45,88.28 v6.99,85.74
!DA00
  Bottom 0.254: J14.1 C36L.2
!DA01
  Bottom 0.254: J13.1 C36L.4
!DA02
  Bottom 0.254: J12.1 C36L.6
!DA03
  Bottom 0.254: J11.1 C36L.8
!DA04
  Bottom 0.254: J10.1 C36L.10
!DA05
  Bottom 0.254: J9.1 C36L.12
!DA06
  Bottom 0.254: J8.1 C36L.14
!DA07
  Bottom 0.254: J7.1 C36L.16
!DA08
  Bottom 0.254: J6.1 C36L.18
!DA09
  Bottom 0.254: J5.1 C36L.22
!DA10
  Bottom 0.254: J4.1 C36L.24
!DA11
  Bottom 0.254: J3.1 C36L.26
!DATA00
  Bottom 0.254: IC34.12 24.13,20.34 22.86,21.61 9.53,21.61 8.26,22.88 C35L.2
!DATA01
  Bottom 0.254: IC34.14 20.32,25.41 19.05,24.14 9.53,24.14 8.26,25.41 C35L.4
!DATA02
  Bottom 0.254: IC34.16 24.13,30.5 22.86,31.77 13.34,31.77 10.79,29.23 9.53,29.23 8.26,27.96 C35L.6
!DATA03
  Bottom 0.254: IC34.18 20.32,35.58 19.05,34.3 13.34,34.3 10.79,31.77 9.53,31.77 8.26,30.5 C35L.8
!DATA04  (via drill 0.61)
  Top 0.254: v2.54,69.86 1.27,68.59 1.27,20.34 5.08,16.53 8.89,16.53 8.89,31.13 7.62,32.4 C35L.10
  Bottom 0.254: v2.54,69.86 15.24,69.86 16.51,68.59 IC26.3
!DATA05  (via drill 0.61)
  Top 0.254: v12.7,63.52 12.7,40.02 12.06,39.38 v12.06,38.12
  Bottom 0.254: v12.06,38.12 10.79,36.84 9.53,36.84 8.26,35.58 C35L.12 | v12.7,63.52 IC26.5
!DATA06  (via drill 0.61)
  Top 0.254: v14.61,58.44 13.34,57.16 v13.34,39.38
  Bottom 0.254: v13.34,39.38 9.53,39.38 8.26,38.12 C35L.14 | v14.61,58.44 IC26.7
!DATA07  (via drill 0.61)
  Top 0.254: v14.61,41.92 v14.61,52.09
  Bottom 0.254: v14.61,52.09 15.24,52.09 16.51,53.36 IC26.9 | v14.61,41.92 9.53,41.92 8.26,40.66 C35L.16
!DATA08  (via drill 0.61)
  Top 0.254: v24.13,45.73 23.5,46.37 23.5,51.45 IC26.12
  Bottom 0.254: v24.13,45.73 12.06,45.73 10.79,44.47 9.53,44.47 8.26,43.2 C35L.18
!DATA09  (via drill 0.61)
  Top 0.254: v8.89,57.16 8.89,50.18 7.62,48.91 C35L.22
  Bottom 0.254: v8.89,57.16 22.86,57.16 24.13,58.44 IC26.14
!DATA10  (via drill 0.61)
  Top 0.254: v11.43,52.09 v11.43,62.24
  Bottom 0.254: v11.43,62.24 22.86,62.24 24.13,63.52 IC26.16 | v11.43,52.09 9.53,52.09 8.26,50.81 C35L.24
!DATA11  (via drill 0.61)
  Top 0.254: v3.17,53.36 v3.17,67.33
  Bottom 0.254: v3.17,67.33 22.86,67.33 24.13,68.59 IC26.18 | v3.17,53.36 C35L.26
!DCXA
  Top 0.254: IC18.9 161.93,118.76 160.66,118.76 IC18.10
  Bottom 0.254: IC16.12 106.05,121.3 158.12,121.3 IC18.10
!DIMA  (via drill 0.61)
  Top 0.254: IC37.1 196.22,32.4 196.22,59.07 IC30.1 195.58,63.52 195.58,112.41 v193.68,114.31 | IC17.11 v134.62,114.31
  Bottom 0.254: v134.62,114.31 v193.68,114.31 | IC30.19 204.47,58.44 201.93,60.98 IC30.1
!DIML  (via drill 0.61)
  Top 0.254: v186.69,73.67 186.69,20.34 187.96,19.07 INTENB.11 | v128.27,102.89 130.81,105.42 130.81,116.86 132.08,118.12 IC17.12 | v206.38,90.82 207.65,89.55 207.65,78.12 FIELD.11
  Bottom 0.254: v186.69,73.67 190.5,77.48 200.66,77.48 201.93,76.22 FIELD.11 | v128.27,102.89 171.45,102.89 173.35,100.98 196.22,100.98 196.85,100.34 199.39,100.34 206.38,93.36 v206.38,90.82
!DMA-IN  (via drill 0.61)
  Top 0.254: v26.67,13.99 22.23,18.43 22.23,33.04 20.32,34.94 20.32,38.12 IC34.1 17.78,48.27 19.68,50.18 19.68,71.77 IC26.1 17.78,76.85 19.05,78.12 19.05,109.23 20.32,110.5 IC13.4
  Bottom 0.254: v26.67,13.99 36.2,13.99 39.37,10.81 71.75,10.81 IC41.12 | IC26.19 21.59,71.14 19.05,73.67 IC26.1
!DMA-OUT  (via drill 0.61)
  Top 0.254: IC28.19 62.87,69.23 62.87,40.02 IC35.19 | v64.77,21.61 v64.77,38.12 | v80.64,18.43 IC41.9 | IC28.1 51.44,71.77 51.44,49.55 52.7,48.27 52.7,41.29 IC35.1
  Bottom 0.254: IC35.1 54.61,40.66 57.15,38.12 IC35.19 v64.77,38.12 | v80.64,18.43 80.01,17.8 68.58,17.8 v64.77,21.61
!DRV01  (via drill 0.61)
  Top 0.254: v69.85,12.71 73.66,8.91 IC41.4 | v55.88,12.71 51.44,17.16 v51.44,24.14
  Bottom 0.254: v55.88,12.71 v69.85,12.71 | v51.44,24.14 50.16,25.41 RS08.38
!DRV23  (via drill 0.61)
  Top 0.254: v78.74,44.47 78.11,43.83 78.11,19.7 80.01,17.8 80.01,10.18 81.28,8.91 IC41.7
  Bottom 0.254: v78.74,44.47 47.62,44.47 46.35,45.73 RS08.22
!DRVOK  (via drill 0.61)
  Top 0.254: R2.1 RS08.40 | v46.99,93.36 46.99,97.81 46.35,98.44 46.35,102.25 45.72,102.89 IC21.14 | v53.34,78.75 v53.34,93.36 | v58.42,78.75 57.78,78.12 57.78,43.2 59.05,41.92 59.05,34.94 58.42,34.3 58.42,32.4 57.78,31.77 v57.78,21.61
  Bottom 0.254: IC21.14 46.35,103.52 47.62,103.52 IC21.13 | v53.34,93.36 v46.99,93.36 | v58.42,78.75 v53.34,78.75 | v57.78,21.61 47.62,21.61 46.35,22.88 RS08.40
!EXAD0  (via drill 0.61)
  Top 0.254: v4.45,77.48 5.08,76.85 5.08,66.69 7.62,64.15 C35L.34
  Bottom 0.254: v4.45,77.48 19.68,92.72 24.13,92.72 IC20.9
!EXAD1  (via drill 0.61)
  Top 0.254: v8.26,92.72 5.71,90.19 5.71,67.33 6.99,66.06 C35L.36
  Bottom 0.254: v8.26,92.72 8.89,92.72 9.53,93.36 19.68,93.36 IC20.7
!EXAD2  (via drill 0.61)
  Top 0.254: v8.89,94 9.53,93.36 9.53,72.41 8.89,71.77 8.89,70.5 7.62,69.23 C35L.38
  Bottom 0.254: v8.89,94 15.24,94 IC20.5
!INT_RQ  (via drill 0.61)
  Top 0.254: IC55.3 135.25,15.89 135.25,12.08 IC55.6 | v149.22,55.9 149.22,12.08 IC55.8
  Bottom 0.254: IC55.6 138.43,10.18 140.97,7.63 IC55.8 | v149.22,55.9 153.67,55.9 156.21,58.44 D34L.30
!IOS  (via drill 0.61)
  Top 0.254: v111.76,131.46 111.76,128.92 90.81,128.92 82.55,120.67 82.55,109.23 78.74,105.42 IC22.10 | v186.69,135.9 189.23,133.36 v189.23,99.08 | v169.54,92.09 168.91,91.45 168.91,57.8 170.18,56.53 D34L.28
  Bottom 0.254: v111.76,131.46 114.94,134.63 157.48,134.63 158.12,135.27 186.06,135.27 v186.69,135.9 | v189.23,99.08 189.23,92.09 v169.54,92.09
!MYDEV
  Top 0.254: 90.17,55.9 91.44,57.16 IC29.4 | 90.17,55.9 90.17,45.73 91.44,44.47 IC32.4 | 90.17,55.9 90.17,71.14 91.44,72.41 IC25.4
  Bottom 0.254: IC32.4 99.06,35.58 PAD1.1
!NXD  (via drill 0.61)
  Top 0.254: v176.53,4.46 176.53,1.92 112.39,1.92 IC23.6 | v208.91,8.91 210.19,10.18 210.19,108.6 208.91,109.87 207.65,109.87 207.65,108.6 IC12.12
  Bottom 0.254: v176.53,4.46 177.8,5.73 201.29,5.73 204.47,8.91 v208.91,8.91
!PER  (via drill 0.61)
  Top 0.254: v142.88,132.09 142.88,121.3 144.15,120.03 v144.15,104.16
  Bottom 0.254: v144.15,104.16 144.78,104.79 181.61,104.79 182.88,103.52 197.49,103.52 IC12.4 | v142.88,132.09 IC9.8
!SETNXD  (via drill 0.61)
  Top 0.254: v62.87,95.9 v62.87,102.89 | v95.25,94.63 95.25,29.23 100.33,24.14 100.33,10.18 101.6,8.91 IC23.4
  Bottom 0.254: v62.87,102.89 59.69,102.89 IC21.9 | v62.87,95.9 64.14,94.63 71.75,94.63 72.39,94 84.45,94 85.09,94.63 v95.25,94.63
!SETPER  (via drill 0.61)
  Top 0.254: v24.13,128.92 24.13,114.31 22.86,113.05 IC13.5 | v114.3,127.65 113.67,128.28 113.67,138.44 118.11,142.89 118.11,147.97 120.65,150.51 128.27,150.51 128.27,134.63 129.54,133.36 IC9.10
  Bottom 0.254: v24.13,128.92 24.77,128.28 113.67,128.28 v114.3,127.65
!SETWLS  (via drill 0.61)
  Top 0.254: v161.29,127.02 161.29,134.63 162.56,135.9 IC6.7 | v130.18,127.65 IC9.4
  Bottom 0.254: v130.18,127.65 130.81,127.02 v161.29,127.02
!SKIP  (via drill 0.61)
  Top 0.254: IC19.6 185.42,90.19 182.88,92.72 IC19.10 v182.88,105.42 | v124.46,105.42 IC17.2
  Bottom 0.254: R1.1 170.81,86.38 171.45,87.01 173.35,87.01 IC19.2 177.16,87.01 183.51,87.01 IC19.6 | v124.46,105.42 125.09,104.79 142.24,104.79 142.88,105.42 v182.88,105.42
!START  (via drill 0.61)
  Top 0.254: 131.44,45.1 131.44,14.62 DMA0-3.11 | 131.44,45.1 DMA4-7.11 | 131.44,45.1 131.44,79.39 DMA8-11.11 | v154.31,107.97 154.31,109.87 154.94,110.5 IC18.3 | v139.06,107.97 137.16,106.06 137.16,96.53 133.99,93.36 133.99,81.93 v133.35,81.3
  Bottom 0.254: v154.31,107.97 153.67,107.33 149.86,107.33 148.59,108.6 139.7,108.6 v139.06,107.97 | v133.35,81.3 DMA8-11.11
!WE  (via drill 0.61)
  Top 0.254: v47.62,75.58 46.99,74.95 46.99,65.42 45.72,64.15 RS08.8 | v78.74,80.66 IC22.5 v81.92,99.71 | v135.89,139.08 135.89,109.23 126.36,99.71 123.83,99.71 v123.83,98.44
  Bottom 0.254: v78.74,80.66 52.7,80.66 v47.62,75.58 | v135.89,139.08 136.53,139.71 154.94,139.71 IC6.5 | v123.83,98.44 123.19,99.08 90.81,99.08 90.17,98.44 83.19,98.44 v81.92,99.71
!WLS  (via drill 0.61)
  Top 0.254: v133.35,107.97 133.35,121.94 132.08,123.2 IC9.6 | v148.59,107.33 151.76,107.33 v151.76,108.6
  Bottom 0.254: v133.35,107.97 134.62,106.7 147.96,106.7 v148.59,107.33 | v151.76,108.6 152.4,109.23 195.58,109.23 196.85,110.5 203.2,110.5 204.47,109.23 IC12.13
BAC00
  Top 0.254: DMA0-3.9 128.27,7.63 123.83,12.08 123.83,13.35 123.19,13.99 119.38,13.99 113.03,7.63 111.76,7.63 D36L.2
BAC01  (via drill 0.61)
  Top 0.254: v127.64,13.99 127.64,12.08 DMA0-3.10 | v115.57,13.99 113.03,16.53 113.03,23.51 111.76,24.78 D36L.4
  Bottom 0.254: v115.57,13.99 v127.64,13.99
BAC02
  Bottom 0.254: DMA0-3.1 120.65,25.41 119.38,26.69 113.67,26.69 112.39,27.96 D36L.6
BAC03  (via drill 0.61)
  Top 0.254: v126.36,31.77 v126.36,22.88
  Bottom 0.254: v126.36,22.88 DMA0-3.15 | D36L.8 112.39,30.5 113.67,31.77 v126.36,31.77 161.29,31.77 163.83,29.23 207.65,29.23 207.65,19.7 207.01,19.07 204.47,19.07 201.93,16.53 196.85,16.53 196.22,15.89 192.41,15.89 INTENB.10
BAC04  (via drill 0.61)
  Top 0.254: v165.1,35.58 165.1,10.18 INTENB.1 | v144.78,34.94 DAR4-7.9 | v113.03,36.84 113.03,34.94 111.76,33.67 D36L.10
  Bottom 0.254: DMA4-7.9 130.81,41.92 132.08,43.2 142.24,43.2 143.51,41.92 DAR4-7.9 | v165.1,35.58 164.47,34.94 v144.78,34.94 142.88,36.84 v113.03,36.84
BAC05  (via drill 0.61)
  Top 0.254: v175.26,34.94 175.26,21.61 177.8,19.07 INTENB.15 | v146.69,36.21 146.69,42.56 DAR4-7.10 | v123.83,39.38 125.09,40.66 v125.09,44.47
  Bottom 0.254: DAR4-7.10 142.88,44.47 141.6,45.73 132.08,45.73 130.81,44.47 DMA4-7.10 v125.09,44.47 | v175.26,34.94 173.35,36.84 165.1,36.84 163.83,35.58 147.32,35.58 v146.69,36.21 | v123.83,39.38 110.49,39.38 110.49,37.48 111.76,36.21 D36L.12
BAC06  (via drill 0.61)
  Top 0.254: v136.53,71.14 136.53,60.34 DAR4-7.1 | v113.03,59.7 113.03,40.02 111.76,38.75 D36L.14
  Bottom 0.254: DAR4-7.1 135.89,59.7 134.62,60.98 124.46,60.98 123.19,59.7 DMA4-7.1 v113.03,59.7 | v136.53,71.14 139.7,71.14 140.97,72.41 203.2,72.41 204.47,73.67 FIELD.10
BAC07  (via drill 0.61)
  Top 0.254: v187.96,86.38 183.51,81.93 v183.51,80.66 | v140.34,73.04 v140.34,58.44 | v109.86,57.16 109.86,43.2 111.76,41.29 D36L.16
  Bottom 0.254: 132.08,58.44 130.81,57.16 DMA4-7.15 | 132.08,58.44 v140.34,58.44 141.6,57.16 DAR4-7.15 | v187.96,86.38 194.31,86.38 196.85,88.92 FIELD.1 | v183.51,80.66 175.9,73.04 v140.34,73.04 | v109.86,57.16 117.47,57.16 118.75,58.44 132.08,58.44
BAC08  (via drill 0.61)
  Top 0.254: v115.57,74.95 v115.57,41.92
  Bottom 0.254: FIELD.15 204.47,86.38 203.2,85.11 186.69,85.11 175.26,73.67 156.84,73.67 154.94,75.58 154.31,75.58 153.67,74.95 147.96,74.95 146.69,76.22 DAR8-11.9 142.24,76.22 140.97,77.48 132.08,77.48 130.81,76.22 DMA8-11.9 125.73,76.22 124.46,74.95 v115.57,74.95 | v115.57,41.92 113.67,41.92 112.39,43.2 D36L.18
BAC09  (via drill 0.61)
  Top 0.254: v116.84,49.55 118.11,48.27 v118.11,38.12 | v163.19,36.84 166.37,40.02 166.37,56.53 163.83,59.07 163.83,74.95 165.1,76.22 166.37,76.22 166.37,71.77 v165.74,71.14 | v149.22,71.14 v149.22,78.75
  Bottom 0.254: DMA8-11.10 134.62,78.75 135.89,80.03 142.24,80.03 143.51,78.75 DAR8-11.10 v149.22,78.75 | v116.84,49.55 113.67,49.55 112.39,48.27 D36L.22 | v118.11,38.12 118.75,37.48 162.56,37.48 v163.19,36.84 | v165.74,71.14 v149.22,71.14
BAC10  (via drill 0.61)
  Top 0.254: v108.58,50.81 107.95,51.45 v107.95,92.72
  Bottom 0.254: DAR8-11.1 135.89,94 134.62,95.27 124.46,95.27 123.19,94 DMA8-11.1 109.22,94 v107.95,92.72 | v108.58,50.81 D36L.24
BAC11  (via drill 0.61)
  Top 0.254: v113.03,92.72 108.58,88.28 108.58,59.7 111.12,57.16 110.49,56.53 110.49,55.26 111.76,53.99 D36L.26
  Bottom 0.254: 132.08,92.72 130.81,91.45 DMA8-11.15 | 132.08,92.72 140.34,92.72 141.6,91.45 DAR8-11.15 | v113.03,92.72 132.08,92.72
BINIT  (via drill 0.61)
  Top 0.254: IC9.11 127,128.28 124.46,125.75 IC9.3 124.46,123.2 123.19,121.94 123.19,99.08 119.38,95.27 v119.38,66.06 119.38,15.26 v113.03,8.91 | IC10.3 152.4,125.75 154.94,128.28 IC10.11
  Bottom 0.254: IC9.11 128.91,134 153.03,134 IC10.11 | v113.03,8.91 112.39,9.54 100.97,9.54 IC23.3 | v119.38,66.06 118.11,67.33 113.67,67.33 112.39,68.59 D36L.38
BIOP1  (via drill 0.61)
  Top 0.254: v102.23,55.26 100.33,53.36 100.33,48.27 96.52,44.47 IC32.6
  Bottom 0.254: v102.23,55.26 102.87,55.9 D36L.28
BIOP2
  Bottom 0.254: IC29.6 98.42,60.34 109.22,60.34 111.12,58.44 D36L.30
BIOP4  (via drill 0.61)
  Top 0.254: v97.79,61.61 97.79,71.14 96.52,72.41 IC25.6
  Bottom 0.254: v97.79,61.61 98.42,60.98 D36L.32
BMB00
  Bottom 0.254: IC35.8 54.61,22.88 55.88,24.14 69.22,24.14 70.48,22.88 D35L.2
BMB01
  Bottom 0.254: IC35.6 54.61,27.96 55.88,26.69 65.41,26.69 66.67,25.41 D35L.4
BMB02  (via drill 0.61)
  Top 0.254: v55.88,29.23 55.88,30.5 IC35.4
  Bottom 0.254: v55.88,29.23 69.22,29.23 70.48,27.96 D35L.6
BMB03  (via drill 0.61)
  Top 0.254: v55.88,34.3 55.24,34.94 55.24,36.21 IC35.2
  Bottom 0.254: v55.88,34.3 68.58,34.3 | 68.58,34.3 69.85,33.04 D35L.10 | 68.58,34.3 68.58,31.13 70.48,29.23 74.3,29.23 78.11,25.41 86.36,25.41 IC36.3
BMB04  (via drill 0.61)
  Top 0.254: v85.09,36.84 85.09,25.41 86.36,24.14 IC36.2 | v67.94,64.78 67.94,41.92 71.12,38.75 D35L.14
  Bottom 0.254: v85.09,36.84 73.03,36.84 71.75,38.12 D35L.14 | v67.94,64.78 67.31,65.42 62.87,65.42 62.23,66.06 IC28.17
BMB05  (via drill 0.61)
  Top 0.254: v80.64,38.12 80.64,33.67 82.55,31.77 82.55,25.41 83.82,24.14 IC36.1 | v61.59,43.2 61.59,45.73 59.05,48.27 59.05,59.07 IC28.15
  Bottom 0.254: v80.64,38.12 76.83,41.92 73.03,41.92 71.75,43.2 D35L.18 v61.59,43.2
BMB06  (via drill 0.61)
  Top 0.254: v69.85,59.7 69.85,52.72 71.12,51.45 D35L.24 | 87.63,55.9 87.63,45.73 88.9,44.47 IC32.3 | 87.63,55.9 88.9,57.16 IC29.3 | 87.63,55.9 87.63,71.14 88.9,72.41 IC25.3
  Bottom 0.254: v69.85,59.7 66.04,59.7 62.23,55.9 IC28.13 | D35L.24 71.75,50.81 73.03,52.09 75.56,52.09 78.74,55.26 85.72,55.26 IC29.3
BMB07
  Top 0.254: 85.09,55.9 85.09,45.73 86.36,44.47 IC32.2 | 85.09,55.9 86.36,57.16 IC29.2 | 85.09,55.9 85.09,71.14 86.36,72.41 IC25.2
  Bottom 0.254: IC28.11 62.23,50.81 67.31,55.9 D35L.28 71.75,55.9 73.03,54.62 76.83,54.62 78.11,55.9 83.82,55.9 IC29.2
BMB08
  Top 0.254: IC32.1 83.82,44.47 83.19,45.1 83.19,48.91 82.55,49.55 82.55,55.9 83.82,57.16 IC29.1 83.82,61.61 82.55,62.88 82.55,71.14 83.82,72.41 IC25.1
  Bottom 0.254: IC28.8 54.61,55.9 55.24,56.53 59.05,56.53 59.69,57.16 62.23,57.16 66.04,60.98 D35L.32 71.75,60.98 73.03,59.7 79.38,59.7 80.64,58.44 IC29.1
BMB09  (via drill 0.61)
  Top 0.254: v79.38,69.23 82.55,72.41 82.55,92.72 85.09,95.27 85.09,114.95 v84.45,115.58
  Bottom 0.254: IC28.6 54.61,60.98 55.88,62.24 69.22,62.24 70.48,63.52 D35L.34 71.75,63.52 73.03,64.78 74.93,64.78 v79.38,69.23 | 90.17,115.58 90.17,114.31 124.46,114.31 IC17.3 | 90.17,115.58 90.17,118.76 92.71,121.3 97.16,121.3 IC16.14 | v84.45,115.58 90.17,115.58
BMB10  (via drill 0.61)
  Top 0.254: v125.73,107.97 125.73,116.86 127,118.12 IC17.14 | v96.52,107.97 IC16.2 | v74.93,67.33 74.93,100.34 77.47,102.89 v77.47,106.7
  Bottom 0.254: IC28.4 54.61,66.06 55.88,67.33 64.14,67.33 65.41,66.06 D35L.36 71.75,66.06 73.03,67.33 v74.93,67.33 | v125.73,107.97 v96.52,107.97 78.74,107.97 v77.47,106.7
BMB11
  Bottom 0.254: IC28.2 54.61,71.14 55.24,70.5 59.05,70.5 59.69,69.86 69.22,69.86 70.48,68.59 D35L.38
BTS1  (via drill 0.61)
  Top 0.254: v167.64,110.5 167,109.87 v167,71.14 | v113.03,69.86 113.03,67.96 111.76,66.69 D36L.36
  Bottom 0.254: v167.64,110.5 168.28,109.87 178.44,109.87 IC11.3 | v167,71.14 165.74,69.86 v113.03,69.86
BUSY
  Top 0.254: IC11.2 177.8,113.05 177.16,113.68 177.16,117.49 176.53,118.12 176.53,129.55 177.8,130.82 IC7.14
  Bottom 0.254: IC10.9 161.93,134 175.9,134 IC7.14
CIE  (via drill 0.61)
  Top 0.254: v139.06,11.45 139.06,20.97 IC55.1 | v201.93,48.27 201.29,47.64 201.29,8.27 194.31,1.28 181.61,1.28 181.61,7.63 180.34,8.91 INTENB.3
  Bottom 0.254: INTENB.3 178.44,8.27 172.09,8.27 168.91,11.45 v139.06,11.45 120.65,11.45 119.38,10.18 SV1.1 | IC30.15 v201.93,48.27
DAR04  (via drill 0.61)
  Top 0.254: v156.21,45.73 156.84,46.37 156.84,55.26 v156.21,55.9 | IC41.2 69.22,7 70.48,7 IC41.3 | v45.72,78.75 v45.72,84.47 IC21.3 | v83.82,5.09 82.55,3.83 77.47,3.83 77.47,11.45 74.93,13.99 v74.93,19.7 74.93,20.97 76.83,22.88 76.83,45.1 74.93,47.01 74.93,66.06 76.2,67.33 v76.2,82.56 | v108.58,44.47 107.95,43.83 v107.95,19.07
  Bottom 0.254: v156.21,45.73 153.67,43.2 143.51,43.2 142.88,43.83 139.06,43.83 138.43,44.47 DAR4-7.7 135.89,44.47 135.25,43.83 131.44,43.83 130.81,43.2 120.65,43.2 119.38,44.47 v108.58,44.47 | v156.21,55.9 157.48,57.16 IC31.17 | v45.72,78.75 43.18,76.22 SV2.8 | v83.82,5.09 83.19,4.46 71.12,4.46 IC41.3 | v76.2,82.56 73.66,85.11 46.35,85.11 v45.72,84.47 | v107.95,19.07 107.31,18.43 81.92,18.43 80.64,19.7 v74.93,19.7
DAR05  (via drill 0.61)
  Top 0.254: IC21.2 v43.18,87.64 v43.18,73.67 RS08.1 | v116.84,60.98 v116.84,52.09 | v110.49,62.24 109.22,63.52 109.22,87.64 v109.86,88.28
  Bottom 0.254: IC31.15 158.75,52.09 157.48,50.81 140.97,50.81 DAR4-7.6 135.89,47.01 134.62,48.27 120.65,48.27 v116.84,52.09 | SV2.10 v43.18,73.67 | v116.84,60.98 115.57,62.24 v110.49,62.24 | v109.86,88.28 109.22,87.64 75.56,87.64 74.93,87.01 43.81,87.01 v43.18,87.64
DAR06  (via drill 0.61)
  Top 0.254: v140.34,48.91 140.34,53.99 DAR4-7.2 135.25,59.07 135.25,74.31 133.35,76.22 v133.35,80.03 | IC21.1 v40.64,71.14 41.27,70.5 41.27,65.42 v41.91,64.78 | v113.67,80.66 109.86,76.85 109.86,70.5 v110.49,69.86 | v72.39,90.82 v72.39,69.86
  Bottom 0.254: v140.34,48.91 140.97,48.27 157.48,48.27 158.75,47.01 IC31.13 | v40.64,71.14 SV2.12 | v41.91,64.78 43.81,64.78 45.09,66.06 RS08.6 | v133.35,80.03 117.47,80.03 116.84,80.66 116.2,80.66 115.57,80.03 114.3,80.03 v113.67,80.66 | v110.49,69.86 109.86,70.5 74.93,70.5 74.3,69.86 v72.39,69.86 | v72.39,90.82 71.12,92.09 63.5,92.09 60.96,94.63 42.55,94.63 IC21.1
DAR07  (via drill 0.61)
  Top 0.254: v134.62,38.75 134.62,52.09 DAR4-7.3 | IC4.9 109.22,148.6 82.55,148.6 81.92,147.97 81.92,146.7 81.28,146.06 IC3.9 v77.47,140.98 | 49.53,127.02 54.61,127.02 v54.61,140.98 54.61,142.25 53.34,143.52 IC2.9 | 49.53,127.02 33.02,127.02 33.02,135.9 25.4,143.52 IC1.9 | 49.53,127.02 49.53,123.2 46.99,120.67 46.99,110.5 41.91,105.42 41.91,70.5 43.18,69.23 RS08.3 | v179.07,44.47 180.34,43.2 v180.34,33.04
  Bottom 0.254: v134.62,38.75 153.67,38.75 156.84,41.92 IC31.11 161.29,41.92 162.56,43.2 168.28,43.2 169.54,44.47 v179.07,44.47 | RS08.3 SV2.14 | v77.47,140.98 v54.61,140.98 | v180.34,33.04 181.61,31.77 201.29,31.77 206.38,36.84 207.01,36.84 210.82,40.66 210.82,143.52 166.37,143.52 165.74,142.89 149.22,142.89 148.59,143.52 148.59,146.7 111.12,146.7 IC4.9
DAR08  (via drill 0.61)
  Top 0.254: DAR8-11.7 139.7,81.3 139.7,90.82 v141.6,92.72 140.97,93.36 v140.97,140.98 | v38.73,66.06 38.73,86.38 39.37,87.01 v39.37,93.36 | v34.29,96.53 32.38,98.44 32.38,134 22.86,143.52 IC1.10 | v114.3,141.62 106.68,141.62 IC4.10
  Bottom 0.254: v141.6,92.72 157.48,92.72 158.75,91.45 IC24.17 | SV2.16 v38.73,66.06 40.64,66.06 41.91,67.33 43.81,67.33 45.09,68.59 RS08.4 | 48.26,142.25 25.4,142.25 IC1.10 | 48.26,142.25 IC2.10 | 76.2,142.25 48.26,142.25 | 76.2,142.25 IC3.10 | 76.2,142.25 104.14,142.25 IC4.10 | v39.37,93.36 36.2,96.53 v34.29,96.53 | v140.97,140.98 140.34,141.62 v114.3,141.62
DAR09  (via drill 0.61)
  Top 0.254: v29.84,62.24 28.57,63.52 28.57,81.3 29.21,81.93 29.21,83.2 29.84,83.83 29.84,94.63 29.21,95.27 29.21,115.58 26.67,118.12 26.67,138.44 IC1.11 | v132.72,86.38 131.44,87.64 v131.44,101.61 | v114.3,101.61 113.03,102.89 113.03,135.9 107.95,140.98 105.41,140.98 105.41,142.25 104.14,143.52 IC4.11
  Bottom 0.254: 150.5,85.11 150.5,83.2 151.13,82.56 153.67,82.56 154.31,81.93 154.31,80.66 153.67,80.03 143.51,80.03 142.88,80.66 139.06,80.66 138.43,81.3 DAR8-11.6 | 150.5,85.11 157.48,85.11 158.75,86.38 IC24.15 | RS08.5 41.91,66.06 39.37,63.52 SV2.18 34.92,63.52 33.66,62.24 v29.84,62.24 | 46.35,146.7 22.23,146.7 IC1.11 | 46.35,146.7 IC2.11 | 46.35,146.7 74.3,146.7 | 74.3,146.7 IC3.11 | 74.3,146.7 102.23,146.7 IC4.11 | 150.5,85.11 133.99,85.11 v132.72,86.38 | v114.3,101.61 v131.44,101.61
DAR10  (via drill 0.61)
  Top 0.254: v134.62,76.22 134.62,88.92 DAR8-11.2 | v154.94,74.31 157.48,76.85 v157.48,78.75 | v66.04,64.15 65.41,64.78 v65.41,67.33 | v68.58,68.59 v68.58,73.67
  Bottom 0.254: SV2.20 36.2,60.98 36.83,60.34 41.91,60.34 42.55,59.7 43.81,59.7 45.09,60.98 RS08.10 45.72,61.61 48.9,64.78 65.41,64.78 v66.04,64.15 | 135.89,74.95 v134.62,76.22 | 135.89,74.95 146.69,74.95 147.32,74.31 v154.94,74.31 | v157.48,78.75 IC24.13 | v65.41,67.33 66.67,68.59 v68.58,68.59 | v68.58,73.67 79.38,73.67 80.64,72.41 80.64,71.14 109.86,71.14 112.39,73.67 124.46,73.67 126.36,75.58 127.64,75.58 128.27,74.95 135.89,74.95
DAR11  (via drill 0.61)
  Top 0.254: v39.37,58.44 40.01,59.07 v40.01,62.88 | v140.97,88.92 v140.97,78.75 140.97,76.22 v138.43,73.67 | v36.83,99.08 36.83,72.41 32.38,72.41 31.75,71.77 31.75,62.24 33.66,62.24 34.29,61.61 34.29,60.34 35.56,59.07 SV2.22 | v66.04,99.71 67.31,98.44 67.31,91.45 68.58,90.19 v68.58,83.83 | v99.06,83.83 v99.06,90.19 | v127,88.92 v127,74.31
  Bottom 0.254: v40.01,62.88 40.64,63.52 RS08.7 | SV2.22 v39.37,58.44 | v140.97,78.75 142.24,77.48 157.48,77.48 158.75,76.22 IC24.11 | v140.97,88.92 DAR8-11.3 | v36.83,99.08 37.47,99.71 v66.04,99.71 | v68.58,83.83 73.66,83.83 76.2,81.3 78.11,81.3 80.01,83.2 98.42,83.2 v99.06,83.83 | v99.06,90.19 102.23,90.19 102.87,90.82 120.02,90.82 120.65,90.19 125.73,90.19 v127,88.92 | v127,74.31 127.64,73.67 v138.43,73.67
DATA_IN  (via drill 0.61)
  Top 0.254: v80.01,78.12 80.01,94 81.28,95.27 IC22.6 | v123.83,77.48 v123.83,67.96 | v165.74,66.06 167.64,64.15 v167.64,60.98
  Bottom 0.254: v80.01,78.12 113.67,78.12 114.3,78.75 116.2,78.75 117.47,77.48 v123.83,77.48 | v123.83,67.96 151.13,67.96 153.03,66.06 v165.74,66.06 | v167.64,60.98 168.91,59.7 186.06,59.7 187.32,58.44 C36L.30
DIO00  (via drill 0.61)
  Top 0.254: v44.45,122.57 45.72,121.3 IC14.12 | v50.16,27.96 v50.16,19.07 49.53,18.43 v49.53,8.91 | v15.88,16.53 15.88,20.97 | 15.88,20.97 IC34.8 | 15.88,20.97 15.88,74.31 16.51,74.95 16.51,116.86 17.78,118.12 IC13.12
  Bottom 0.254: v44.45,122.57 20.95,122.57 IC13.12 | v50.16,19.07 58.42,19.07 59.69,20.34 IC35.12 | v50.16,27.96 RS08.36 | v15.88,16.53 22.23,10.18 SV1.2 33.66,10.18 34.92,8.91 v49.53,8.91
DIO01  (via drill 0.61)
  Top 0.254: v31.11,26.69 31.11,15.26 33.02,13.35 SV1.4 | v12.06,116.86 8.89,113.68 8.89,95.27 10.16,94 10.16,73.04 11.43,71.77 v11.43,64.78 | v6.35,26.69 v6.35,54.62
  Bottom 0.254: IC14.11 46.35,121.3 22.23,121.3 IC13.11 17.78,116.86 v12.06,116.86 | 45.09,26.69 54.61,26.69 55.24,26.05 59.05,26.05 59.69,25.41 IC35.14 | 45.09,26.69 43.81,25.41 RS08.37 | 20.32,26.69 19.05,27.96 IC34.6 | 45.09,26.69 v31.11,26.69 20.32,26.69 | v11.43,64.78 9.53,64.78 8.89,64.15 8.89,59.7 6.99,59.7 6.35,59.07 v6.35,54.62 | v6.35,26.69 20.32,26.69
DIO02  (via drill 0.61)
  Top 0.254: v20.95,33.04 21.59,32.4 v21.59,15.26 | v59.05,21.61 59.05,28.59 IC35.16 | v39.37,116.86 39.37,94.63 38.1,93.36 v38.1,91.45 | v66.67,90.82 66.04,90.19 66.04,69.23 66.67,68.59 66.67,64.78 67.31,64.15 v67.31,33.04
  Bottom 0.254: IC13.10 25.4,116.86 v39.37,116.86 49.53,116.86 50.8,118.12 IC14.10 | RS08.35 43.81,27.96 45.09,29.23 54.61,29.23 55.88,30.5 IC35.16 64.77,30.5 v67.31,33.04 | v20.95,33.04 IC34.4 | v21.59,15.26 SV1.6 33.66,15.26 34.92,16.53 36.2,16.53 37.47,17.8 39.37,17.8 40.64,16.53 57.15,16.53 59.69,19.07 62.87,19.07 62.87,20.97 62.23,21.61 v59.05,21.61 | v38.1,91.45 61.59,91.45 62.87,90.19 66.04,90.19 v66.67,90.82
DIO03  (via drill 0.61)
  Top 0.254: IC34.2 19.68,36.21 v19.68,29.23 19.68,17.16 v20.32,16.53 | v59.05,31.77 59.05,33.67 IC35.18 | v2.54,108.6 2.54,71.14 3.81,69.86 3.81,69.23 1.91,67.33 1.91,39.38 v3.81,37.48 | v25.4,115.58 IC13.9
  Bottom 0.254: IC13.9 27.3,117.49 35.56,117.49 37.47,119.39 38.73,119.39 39.37,118.76 39.37,118.12 40.01,117.49 48.9,117.49 49.53,118.12 49.53,121.3 51.44,121.3 IC14.9 | v19.68,29.23 36.2,29.23 37.47,30.5 RS08.33 43.81,30.5 45.09,31.77 v59.05,31.77 | v20.32,16.53 31.11,16.53 32.38,17.8 SV1.8 | v25.4,115.58 9.53,115.58 v2.54,108.6 | v3.81,37.48 6.99,34.3 12.06,34.3 15.88,38.12 IC34.2
DIO04  (via drill 0.61)
  Top 0.254: 36.83,21.61 34.92,21.61 33.66,20.34 SV1.10 | 36.83,21.61 v36.83,47.01 | v27.3,82.56 27.3,67.96 IC26.17 | v56.52,82.56 56.52,71.77 IC28.3 | IC15.2 71.12,106.7 69.85,105.42 v69.85,82.56 69.85,67.33 71.75,67.33 72.39,66.69 72.39,36.84 v69.85,36.84 | 36.83,21.61 36.83,15.26 v38.1,13.99 | v48.26,12.71 48.9,13.35 48.9,31.13 52.07,34.3 54.61,34.3 55.88,33.04 56.52,33.04 56.52,33.67 57.15,34.3 57.15,34.94 v56.52,35.58
  Bottom 0.254: v36.83,47.01 43.81,47.01 44.45,46.37 44.45,45.1 45.72,43.83 RS08.24 | v27.3,82.56 v56.52,82.56 57.15,83.2 57.78,83.2 58.42,82.56 v69.85,82.56 | v38.1,13.99 45.09,13.99 46.35,12.71 v48.26,12.71 | v56.52,35.58 57.78,36.84 v69.85,36.84
DIO05  (via drill 0.61)
  Top 0.254: v30.48,41.92 30.48,54.62 27.3,57.8 27.3,59.07 IC26.15 22.86,58.44 22.86,42.56 23.5,41.92 23.5,37.48 24.13,36.84 23.5,36.21 v23.5,24.14 | 57.15,59.7 57.15,42.56 v57.78,41.92 | 57.15,59.7 IC28.5 | v59.05,110.5 59.05,106.06 59.69,105.42 59.69,81.3 57.15,78.75 57.15,59.7
  Bottom 0.254: v30.48,41.92 43.81,41.92 45.09,40.66 RS08.26 48.9,40.66 50.16,41.92 v57.78,41.92 | v59.05,110.5 67.31,110.5 IC15.1 | v23.5,24.14 31.11,24.14 32.38,22.88 SV1.12
DIO06  (via drill 0.61)
  Top 0.254: v26.67,43.83 27.3,44.47 27.3,53.99 IC26.13 | v40.01,44.47 40.64,43.83 v40.64,36.84 40.64,25.41 v39.37,24.14 | v56.52,37.48 56.52,55.26 IC28.7 | v65.41,106.7 65.41,108.6 67.31,110.5 67.31,114.31 71.12,118.12 IC15.13 | v50.8,106.7 49.53,105.42 49.53,89.55 47.62,87.64 47.62,76.85 49.53,74.95 49.53,61.61 v48.9,60.98
  Bottom 0.254: v26.67,43.83 39.37,43.83 v40.01,44.47 | v40.64,36.84 43.81,36.84 | 43.81,36.84 45.09,38.12 RS08.28 | v56.52,37.48 55.88,36.84 43.81,36.84 | v50.8,106.7 v65.41,106.7 | v48.9,60.98 51.44,58.44 IC28.7 | v39.37,24.14 34.92,24.14 33.66,25.41 SV1.14
DIO07  (via drill 0.61)
  Top 0.254: v69.85,106.7 69.85,114.31 73.66,118.12 IC15.12 | v53.34,100.98 52.7,100.34 52.7,98.44 52.07,97.81 52.07,80.03 49.53,77.48 49.53,76.22 50.16,75.58 50.16,54.62 v49.53,53.99 | v33.02,51.45 33.02,45.1 31.75,43.83 31.75,29.86 33.02,28.59 SV1.16 | v50.8,35.58 51.44,36.21 51.44,38.75 52.07,39.38 55.88,39.38 55.88,50.81 IC28.9
  Bottom 0.254: 33.02,52.09 35.56,52.09 36.83,50.81 41.27,50.81 42.55,52.09 48.9,52.09 50.16,53.36 | 33.02,52.09 27.94,52.09 26.67,50.81 IC26.11 | 50.16,53.36 IC28.9 | v69.85,106.7 69.85,102.25 67.31,102.25 66.67,101.61 59.69,101.61 59.05,102.25 54.61,102.25 v53.34,100.98 | 50.16,53.36 v49.53,53.99 | v33.02,51.45 33.02,52.09 | v50.8,35.58 RS08.30
DIO08  (via drill 0.61)
  Top 0.254: v29.21,31.77 v29.21,54.62 | v49.53,33.04 49.53,51.45 v50.16,52.09 50.8,52.72 v50.8,77.48 | v61.59,78.75 61.59,121.3 74.3,121.3 IC15.11
  Bottom 0.254: v29.21,54.62 20.32,54.62 19.05,55.9 IC26.8 | v29.21,31.77 30.48,30.5 SV1.18 33.66,30.5 34.92,31.77 43.81,31.77 45.09,33.04 RS08.32 v49.53,33.04 | v50.16,52.09 58.42,52.09 59.69,53.36 IC28.12 | v61.59,78.75 60.33,77.48 v50.8,77.48
DIO09  (via drill 0.61)
  Top 0.254: v77.47,126.38 77.47,121.94 78.74,120.67 IC15.10 | v12.7,91.45 13.97,90.19 13.97,66.06 12.7,64.78 14.61,62.88 v14.61,60.98 | v30.48,33.04 v30.48,38.12 | v27.94,38.12 v27.94,55.9
  Bottom 0.254: RS08.29 42.55,35.58 41.27,34.3 34.92,34.3 33.66,33.04 SV1.20 v30.48,33.04 | 29.21,57.16 58.42,57.16 59.69,58.44 IC28.14 | 29.21,57.16 26.67,59.7 20.32,59.7 19.05,60.98 IC26.6 v14.61,60.98 | v77.47,126.38 76.83,127.02 7.62,127.02 1.27,120.67 1.27,91.45 v12.7,91.45 | v30.48,38.12 v27.94,38.12 | v27.94,55.9 29.21,57.16
DIO10  (via drill 0.61)
  Top 0.254: v12.7,80.66 v12.7,66.06 | v25.4,92.09 26.67,93.36 v26.67,107.97 | v78.74,109.23 80.01,110.5 80.01,116.86 81.28,118.12 IC15.9 | v64.77,63.52 64.14,64.15 v64.14,109.23 | v48.26,39.38 47.62,40.02 47.62,61.61 v48.26,62.24
  Bottom 0.254: SV1.22 33.66,35.58 34.92,36.84 39.37,36.84 40.64,38.12 RS08.27 43.81,38.12 45.09,39.38 v48.26,39.38 | v12.7,80.66 24.13,92.09 v25.4,92.09 | v26.67,107.97 27.94,109.23 v64.14,109.23 v78.74,109.23 | v12.7,66.06 IC26.4 | v64.77,63.52 IC28.16 55.88,63.52 54.61,62.24 v48.26,62.24
DIO11  (via drill 0.61)
  Top 0.254: v85.09,93.36 85.72,94 85.72,116.22 83.82,118.12 IC15.8 | v66.04,93.36 65.41,92.72 v65.41,68.59 | v21.59,39.38 21.59,62.88 20.95,63.52 20.95,69.23 v21.59,69.86
  Bottom 0.254: RS08.25 42.55,40.66 41.27,39.38 34.92,39.38 33.66,38.12 SV1.24 32.38,38.12 31.11,39.38 v21.59,39.38 | IC26.2 19.05,71.14 20.32,69.86 v21.59,69.86 58.42,69.86 59.69,68.59 IC28.18 v65.41,68.59 | v66.04,93.36 v85.09,93.36
DIOEVEN  (via drill 0.61)
  Top 0.254: v50.16,30.5 50.16,29.23 54.61,29.23 55.24,28.59 55.24,22.24 IC35.9 | v11.43,86.38 11.43,114.31 15.24,118.12 IC13.13
  Bottom 0.254: v50.16,30.5 RS08.34 | v11.43,86.38 1.27,76.22 1.27,19.07 48.9,19.07 50.16,20.34 IC35.9
DMA00  (via drill 0.61)
  Top 0.254: v150.5,5.73 150.5,10.81 IC38.8 | v28.57,83.83 28.57,82.56 27.94,81.93 27.94,59.07 v31.11,55.9 | v109.22,38.12 110.49,36.84 110.49,7 114.3,7 117.47,10.18 DMA0-3.7 | v78.11,76.22 v78.11,50.81 | v62.87,91.45 v62.87,78.75 | v34.29,92.72 33.02,91.45 SV2.1
  Bottom 0.254: v150.5,5.73 127.64,5.73 123.19,10.18 DMA0-3.7 | 37.47,54.62 36.2,55.9 SV2.24 | 37.47,54.62 43.81,54.62 45.09,53.36 RS08.16 | v31.11,55.9 32.38,54.62 37.47,54.62 | v28.57,83.83 SV2.1 | v109.22,38.12 101.6,45.73 83.19,45.73 v78.11,50.81 | v78.11,76.22 75.56,78.75 v62.87,78.75 | v62.87,91.45 62.23,92.09 38.73,92.09 38.1,92.72 v34.29,92.72